# EAGLE design Sensor_v1.0 (EAGLE 9.3.0)

## Sheet 1 of 2
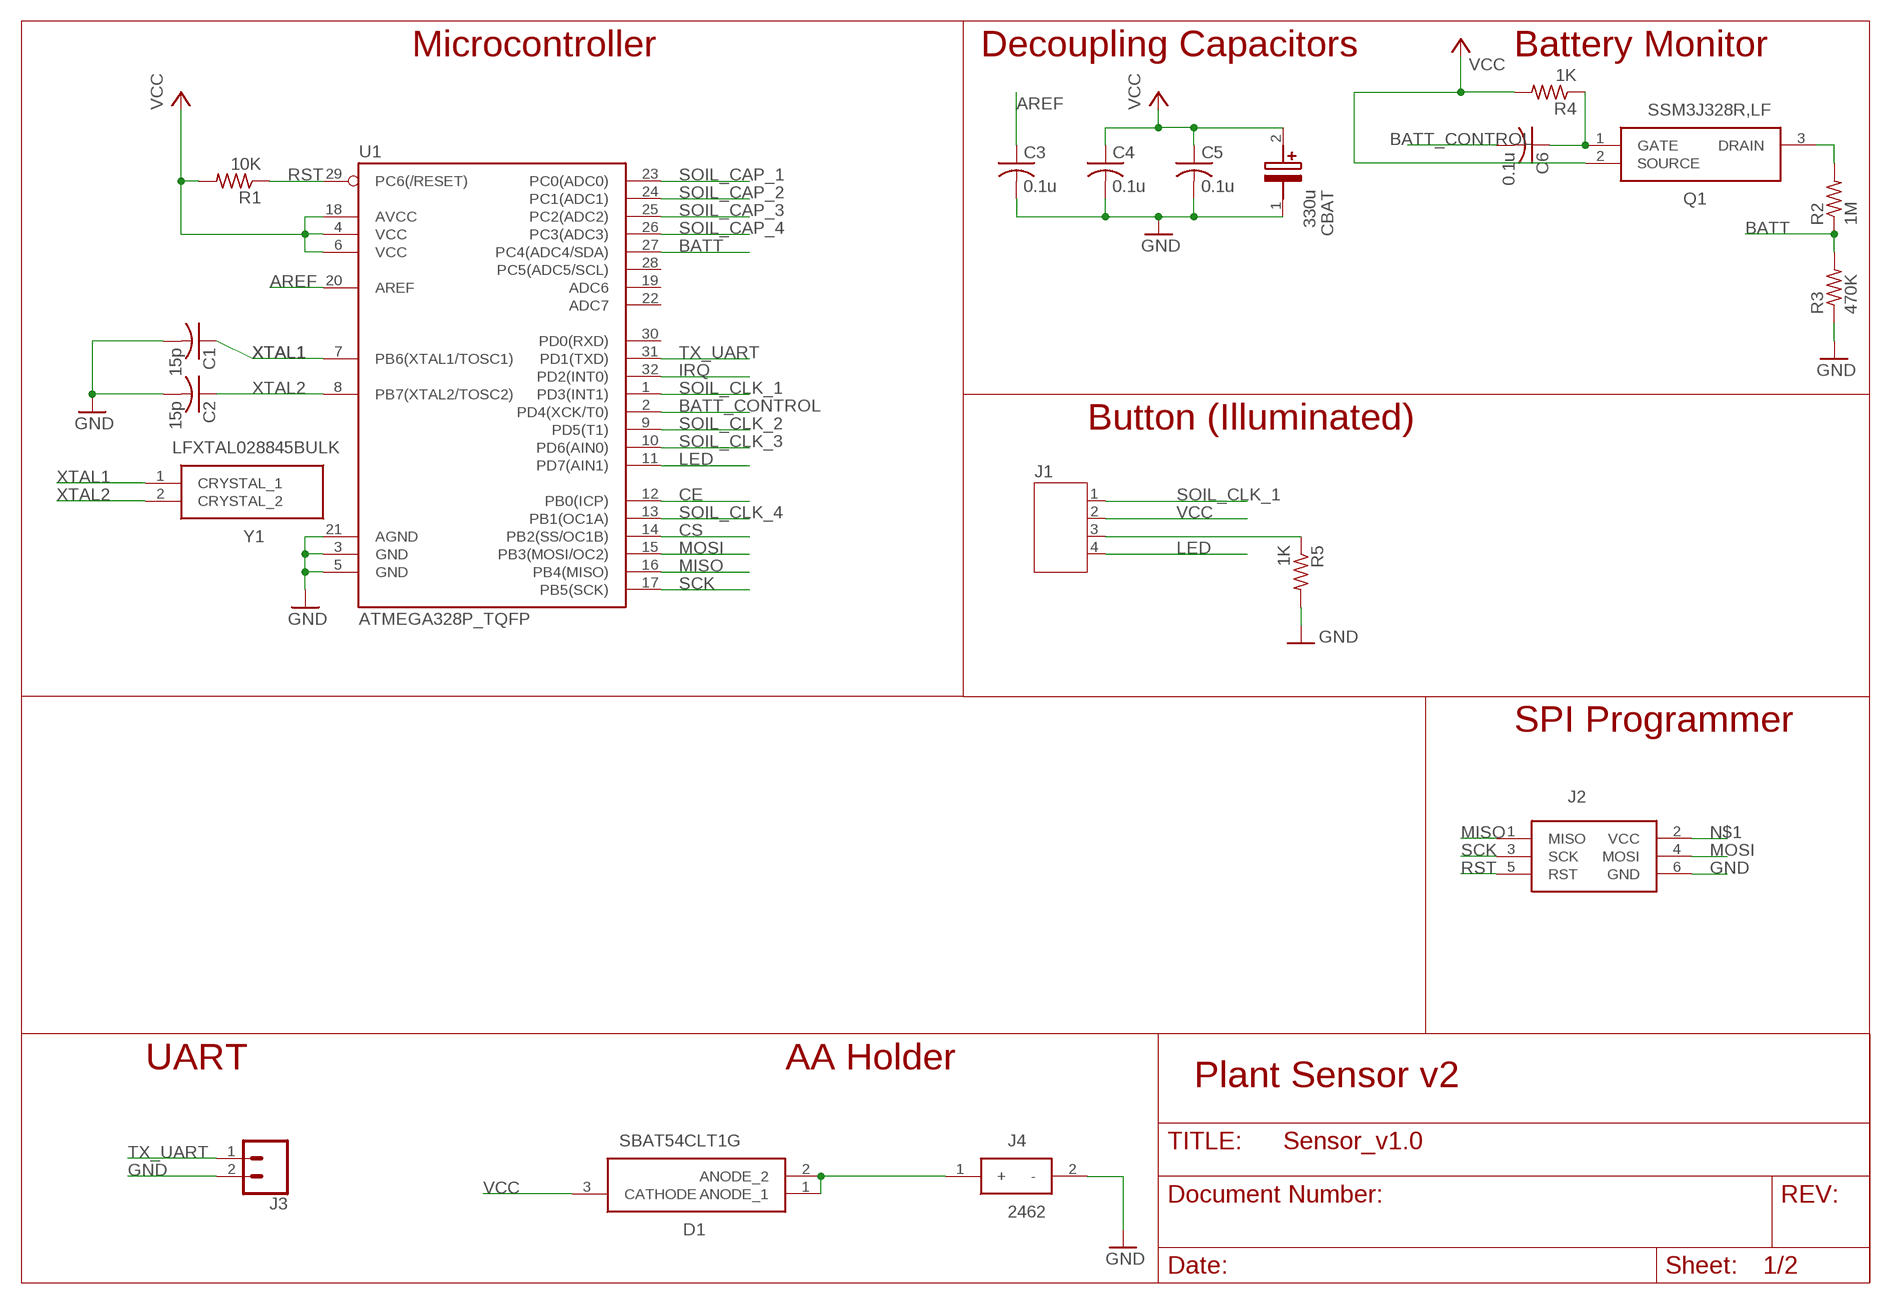
[diagram p0: schematic, sheet 1]

### Parts
C1  15p  CAPACITOR-SMD-0805  [SMD-0805]
C2  15p  CAPACITOR-SMD-0805  [SMD-0805]
C3  0.1u  CAPACITOR-SMD-0805  [SMD-0805]
C4  0.1u  CAPACITOR-SMD-0805  [SMD-0805]
C5  0.1u  CAPACITOR-SMD-0805  [SMD-0805]
C6  0.1u  CAPACITOR-SMD-0805  [SMD-0805]
CBAT  330u  EEE-FNC271XUP  [SMD_LYTIC_D8]
D1  SBAT54CLT1G  [SOT96P237X111-3N]
J1  JST-PH4  [JST-PH4]
J2  ISP  AVRISP-6  [AVRISP]
J3  CONN_02  [1X02]
J4  2462  [2462]
Q1  SSM3J328R,LF  [SOTFL95P240X88-3N]
R1  10K  RESISTOR-SMD-0805  [SMD-0805]
R2  1M  RESISTOR-SMD-0805  [SMD-0805]
R3  470K  RESISTOR-SMD-0805  [SMD-0805]
R4  1K  RESISTOR-SMD-0805  [SMD-0805]
R5  1K  RESISTOR-SMD-0805  [SMD-0805]
U1  ATMEGA328P_TQFP  [TQFP32-08]
Y1  LFXTAL028845BULK  [LFXTAL028845BULK]

### Nets
AREF: C3.1 U1.20(AREF)
BATT: R2.1 R3.2 U1.27(PC4(ADC4/SDA))
BATT_CONTROL: C6.2 U1.2(PD4(XCK/T0))
CE: U1.12(PB0(ICP)) ; also sheet 2
CS: U1.14(PB2(SS/OC1B)) ; also sheet 2
GND: C1.2 C2.2 C3.2 C4.2 C5.2 CBAT.1 J2.6(GND) J3.2 J4.2(-) R3.1 R5.2 U1.3(GND) U1.5(GND) U1.21(AGND) ; also sheet 2
IRQ: U1.32(PD2(INT0)) ; also sheet 2
LED: J1.4 U1.11(PD7(AIN1))
MISO: J2.1(MISO) U1.16(PB4(MISO)) ; also sheet 2
MOSI: J2.4(MOSI) U1.15(PB3(MOSI/OC2)) ; also sheet 2
N$1: J2.2(VCC)
N$2: Q1.3(DRAIN) R2.2
N$3: D1.1(ANODE_1) D1.2(ANODE_2) J4.1(+)
N$7: J1.3 R5.1
N$8: C6.1 Q1.1(GATE) R4.1
RST: J2.5(RST) R1.1 U1.29(PC6(/RESET))
SCK: J2.3(SCK) U1.17(PB5(SCK)) ; also sheet 2
SOIL_CAP_1: U1.23(PC0(ADC0)) ; also sheet 2
SOIL_CAP_2: U1.24(PC1(ADC1)) ; also sheet 2
SOIL_CAP_3: U1.25(PC2(ADC2)) ; also sheet 2
SOIL_CAP_4: U1.26(PC3(ADC3)) ; also sheet 2
SOIL_CLK_1: J1.1 U1.1(PD3(INT1)) ; also sheet 2
SOIL_CLK_2: U1.9(PD5(T1)) ; also sheet 2
SOIL_CLK_3: U1.10(PD6(AIN0)) ; also sheet 2
SOIL_CLK_4: U1.13(PB1(OC1A)) ; also sheet 2
TX_UART: J3.1 U1.31(PD1(TXD))
VCC: C4.1 C5.1 CBAT.2 D1.3(CATHODE) J1.2 Q1.2(SOURCE) R1.2 R4.2 U1.4(VCC) U1.6(VCC) U1.18(AVCC) ; also sheet 2
XTAL1: C1.1 U1.7(PB6(XTAL1/TOSC1)) Y1.1(CRYSTAL_1)
XTAL2: C2.1 U1.8(PB7(XTAL2/TOSC2)) Y1.2(CRYSTAL_2)
Unconnected: U1.19(ADC6) U1.22(ADC7) U1.28(PC5(ADC5/SCL)) U1.30(PD0(RXD))

### Notes on the sheet
- Microcontroller | Decoupling Capacitors | Battery Monitor
- Button (Illuminated)
- SPI Programmer
- UART | AA Holder
- Plant Sensor v2

## Sheet 2 of 2
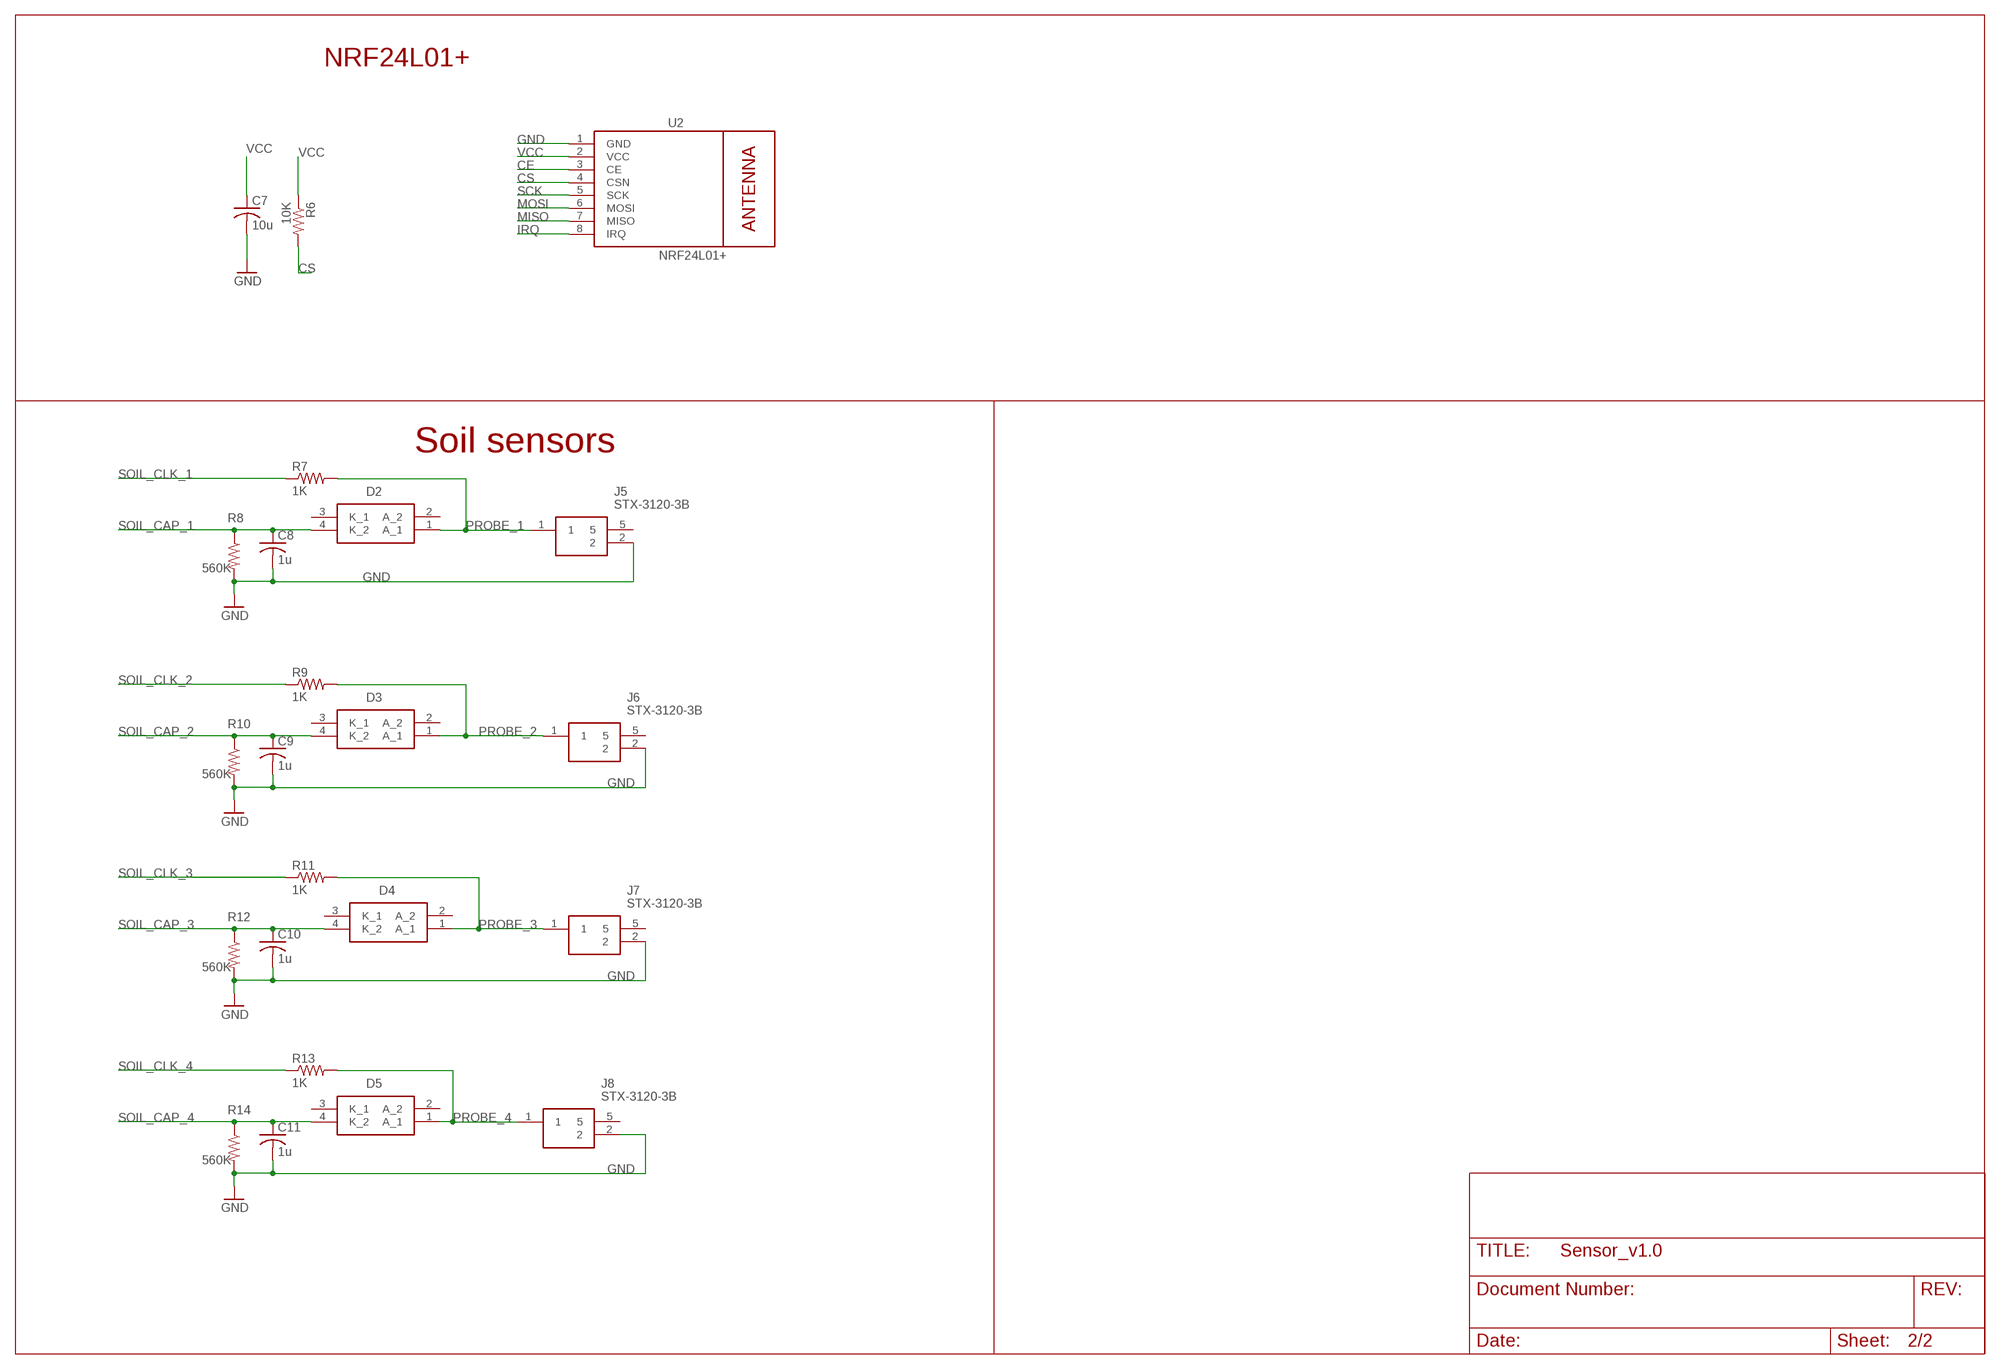
[diagram p1: schematic, sheet 2]

### Parts
C7  10u  CAPACITOR-SMD-0805  [SMD-0805]
C8  1u  CAPACITOR-SMD-0805  [SMD-0805]
C9  1u  CAPACITOR-SMD-0805  [SMD-0805]
C10  1u  CAPACITOR-SMD-0805  [SMD-0805]
C11  1u  CAPACITOR-SMD-0805  [SMD-0805]
D2  1SS384TE85LF  [SOP65P210X110-4N]
D3  1SS384TE85LF  [SOP65P210X110-4N]
D4  1SS384TE85LF  [SOP65P210X110-4N]
D5  1SS384TE85LF  [SOP65P210X110-4N]
J5  STX-3120-3B  [STX31203B]
J6  STX-3120-3B  [STX31203B]
J7  STX-3120-3B  [STX31203B]
J8  STX-3120-3B  [STX31203B]
R6  10K  RESISTOR-SMD-0805  [SMD-0805]
R7  1K  RESISTOR-SMD-0805  [SMD-0805]
R8  560K  RESISTOR-SMD-0805  [SMD-0805]
R9  1K  RESISTOR-SMD-0805  [SMD-0805]
R10  560K  RESISTOR-SMD-0805  [SMD-0805]
R11  1K  RESISTOR-SMD-0805  [SMD-0805]
R12  560K  RESISTOR-SMD-0805  [SMD-0805]
R13  1K  RESISTOR-SMD-0805  [SMD-0805]
R14  560K  RESISTOR-SMD-0805  [SMD-0805]
U2  NRF24L01+  WIRELESS-NRF24L01  [WIRELESS-NRF24L01]

### Nets
CE: U2.3(CE) ; also sheet 1
CS: R6.2 U2.4(CSN) ; also sheet 1
GND: C7.2 C8.2 C9.2 C10.2 C11.2 J5.2 J6.2 J7.2 J8.2 R8.2 R10.2 R12.2 R14.2 U2.1(GND) ; also sheet 1
IRQ: U2.8(IRQ) ; also sheet 1
MISO: U2.7(MISO) ; also sheet 1
MOSI: U2.6(MOSI) ; also sheet 1
PROBE_1: D2.1(A_1) J5.1 R7.2
PROBE_2: D3.1(A_1) J6.1 R9.2
PROBE_3: D4.1(A_1) J7.1 R11.2
PROBE_4: D5.1(A_1) J8.1 R13.2
SCK: U2.5(SCK) ; also sheet 1
SOIL_CAP_1: C8.1 D2.4(K_2) R8.1 ; also sheet 1
SOIL_CAP_2: C9.1 D3.4(K_2) R10.1 ; also sheet 1
SOIL_CAP_3: C10.1 D4.4(K_2) R12.1 ; also sheet 1
SOIL_CAP_4: C11.1 D5.4(K_2) R14.1 ; also sheet 1
SOIL_CLK_1: R7.1 ; also sheet 1
SOIL_CLK_2: R9.1 ; also sheet 1
SOIL_CLK_3: R11.1 ; also sheet 1
SOIL_CLK_4: R13.1 ; also sheet 1
VCC: C7.1 R6.1 U2.2(VCC) ; also sheet 1
Unconnected: D2.2(A_2) D2.3(K_1) D3.2(A_2) D3.3(K_1) D4.2(A_2) D4.3(K_1) D5.2(A_2) D5.3(K_1) J5.5 J6.5 J7.5 J8.5

### Notes on the sheet
- NRF24L01+
- Soil sensors

## Library data of the parts
C1-C11 = Fuzzy:CAPACITOR-SMD-0805
CBAT = SamacSys_Parts:EEE-FNC271XUP: PANASONIC - EEE-FNC271XUP - CAP, 270UF, 16V, ALU ELEC, SMD Source: Datasheet <http://industrial.panasonic.com/cdbs/www-data/pdf/RDE0000/RDE0000C1259.pdf>; DESCRIPTION: PANASONIC - EEE-FNC271XUP - CAP, 270UF, 16V, ALU ELEC, SMD; HEIGHT: 7.8mm; MANUFACTURER_NAME: Panasonic; MANUFACTURER_PART_NUMBER: EEE-FNC271XUP; MOUSER_PART_NUMBER: 667-EEE-FNC271XUP; MOUSER_PRICE-STOCK: https://www.mouser.co.uk/ProductDetail/Panasonic/EEE-FNC271XUP?qs=OlC7AqGiEDk4Wtbs6TVCqQ%3D%3D
D1 = SamacSys_Parts:SBAT54CLT1G: ON SEMICONDUCTOR - SBAT54CLT1G - DIODE, SCHOTTKY, AEC-Q101, 30V, SOT-23 Source: Datasheet <http://www.onsemi.com/pub/Collateral/BAT54CLT1-D.PDF>; DESCRIPTION: ON SEMICONDUCTOR - SBAT54CLT1G - DIODE, SCHOTTKY, AEC-Q101, 30V, SOT-23; HEIGHT: 1.11mm; MANUFACTURER_NAME: ON Semiconductor; MANUFACTURER_PART_NUMBER: SBAT54CLT1G; MOUSER_PART_NUMBER: 863-SBAT54CLT1G; MOUSER_PRICE-STOCK: https://www.mouser.co.uk/ProductDetail/ON-Semiconductor/SBAT54CLT1G?qs=3PKVEWFFm28iDw9tuZM%2FZA%3D%3D
D2-D5 = SamacSys_Parts:1SS384TE85LF: Schottky Diodes & Rectifiers 0.1A 10V Schottky Small Sig Diode Source: Datasheet; DESCRIPTION: Schottky Diodes & Rectifiers 0.1A 10V Schottky Small Sig Diode; HEIGHT: 1.1mm; MANUFACTURER_NAME: Toshiba; MANUFACTURER_PART_NUMBER: 1SS384TE85LF; MOUSER_PART_NUMBER: 757-1SS384TE85LF; MOUSER_PRICE-STOCK: https://www.mouser.co.uk/ProductDetail/Toshiba/1SS384TE85LF?qs=3kEcuH7qFhcYSVeDNmL3eg%3D%3D
J1 = jst-ph:JST-PH4
J2 = adafruit:AVRISP: AVR ISP HEADER Standard 6 pin header for AVR programming
J3 = SparkFun-Connectors:CONN_02: Multi connection point. Often used as Generic Header-pin footprint for 0.1 inch spaced/style header connections On any of the 0.1 inch spaced packages, you can populate with these: Break Away Headers - Straight <https://www.sparkfun.com/products/116> (PRT-00116) Break Away Male Headers - Right Angle <https://www.sparkfun.com/products/553> (PRT-00553) Female Headers <https://www.sparkfun.com/products/115> (PRT-00115) Break Away Headers - Machine Pin <https://www.sparkfun.com/products/117> (PRT-00117) Break Away Female Headers - Swiss Machine Pin <https://www.sparkfun.com/products/743> (PRT-00743) For SCREWTERMINALS and SPRING TERMINALS visit here: Screw Terimnals on SparkFun.com <https://www.sparkfun.com/search/results?term=Screw+Terminals> (5mm/3.5mm/2.54mm spacing) This device is also useful as a general connection point to wire up your design to another part of your project. Our various solder wires solder well into these plated through hole pads. Hook-Up Wire - Assortment (Stranded, 22 AWG) <https://www.sparkfun.com/products/11375> (PRT-11375) Hook-Up Wire - Assortment (Solid Core, 22 AWG) <https://www.sparkfun.com/products/11367> (PRT-11367) View the entire wire category on our website here <https://www.sparkfun.com/categories/141> Special notes: Molex polarized connector foot print use with: PRT-08233 with associated crimp pins and housings. 2.54_SCREWTERM for use with PRT-10571. 3.5mm Screw Terminal footprints for PRT-08084 5mm Screw Terminal footprints for use with PRT-08432
J4 = SamacSys_Parts:2462: KEYSTONE - 2462 - BATTERY HOLDER Source: Datasheet <https://componentsearchengine.com/Datasheets/1/2462.pdf>; DESCRIPTION: KEYSTONE - 2462 - BATTERY HOLDER; HEIGHT: mm; MANUFACTURER_NAME: Keystone Electronics; MANUFACTURER_PART_NUMBER: 2462; MOUSER_PART_NUMBER: 534-2462
J5-J8 = SamacSys_Parts:STX-3120-3B: Phone Connectors 3.5mm PCB STEREO BLK 3P ALL PLASTIC Source: Datasheet <https://componentsearchengine.com/Datasheets/1/STX-3120-3B.pdf>; DESCRIPTION: Phone Connectors 3.5mm PCB STEREO BLK 3P ALL PLASTIC; HEIGHT: 10.8mm; MANUFACTURER_NAME: Kycon; MANUFACTURER_PART_NUMBER: STX-3120-3B; MOUSER_PART_NUMBER: 806-STX-3120-3B; MOUSER_PRICE-STOCK: https://www.mouser.co.uk/ProductDetail/Kycon/STX-3120-3B?qs=tDp7Of2cGGh%2F4wBu%2F49%2FMQ%3D%3D
Q1 = SamacSys_Parts:SSM3J328R,LF: MOSFET P-Ch Sm Sig FET Id -6A -20V -8VGSS Source: Datasheet <https://componentsearchengine.com/Datasheets/1/SSM3J328R,LF.pdf>; DESCRIPTION: MOSFET P-Ch Sm Sig FET Id -6A -20V -8VGSS; HEIGHT: 0.88mm; MANUFACTURER_NAME: Toshiba; MANUFACTURER_PART_NUMBER: SSM3J328R,LF; MOUSER_PART_NUMBER: 757-SSM3J328RLF
R1-R14 = Fuzzy:RESISTOR-SMD-0805
U1 = SparkFun-IC-Microcontroller:ATMEGA328P_TQFP: Popular 328P in QFP Storefront component: ATmega328 - TQFP <https://www.sparkfun.com/products/13448> (COM-13448) Datasheet <http://www.sparkfun.com/datasheets/Components/SMD/ATMega328.pdf> SparkFun Products SparkFun RedBoard - Programmed with Arduino <https://www.sparkfun.com/products/12757> (DEV-12757) Arduino Pro Mini 328 - 5V/16MHz <https://www.sparkfun.com/products/11113> (DEV-11113) Arduino Pro Mini 328 - 3.3V/8MHz <https://www.sparkfun.com/products/11114> (DEV-11114) SparkFun OpenLog <https://www.sparkfun.com/products/13712> (DEV-13712) SparkFun MicroView - OLED Arduino Module <https://www.sparkfun.com/products/12923> (DEV-12923) SparkFun Digital Sandbox <https://www.sparkfun.com/products/12651> (DEV-12651) SparkFun PicoBoard <https://www.sparkfun.com/products/11888> (WIG-11888) Arduino Fio <https://www.sparkfun.com/products/10116> (DEV-10116) LilyPad Arduino 328 Main Board <https://www.sparkfun.com/products/13342> (DEV-13342) SparkFun RedStick <https://www.sparkfun.com/products/13741> (DEV-13741) LilyPad MP3 <https://www.sparkfun.com/products/11013> (DEV-11013) LilyPad Arduino SimpleSnap <https://www.sparkfun.com/products/10941> (DEV-10941) SparkFun Stepoko <https://www.sparkfun.com/products/13899> (ROB-13899) SparkFun Geiger Counter <https://www.sparkfun.com/products/11345> (SEN-11345) SparkFun EL Sequencer <https://www.sparkfun.com/products/12781> (COM-12781) Arduino Pro 328 - 5V/16MHz <https://www.sparkfun.com/products/10915> (DEV-10915) CryptoCape <https://www.sparkfun.com/products/12773> (DEV-12773) SparkFun IR Thermometer Evaluation Board - MLX90614 <https://www.sparkfun.com/products/10740> (SEN-10740) SparkFun RedBot Mainboard <https://www.sparkfun.com/products/12097> (ROB-12097) Arduino Pro 328 - 3.3V/8MHz <https://www.sparkfun.com/products/10914> (DEV-10914) SparkFun Block for Intel® Edison - Arduino <https://www.sparkfun.com/products/13036> (DEV-13036) SparkFun Simon Says - Surface Mount Soldering Kit <https://www.sparkfun.com/products/10935> (KIT-10935) SparkFun 7-Segment Serial Display - Red <https://www.sparkfun.com/products/11441> (COM-11441) SparkFun 7-Segment Serial Display - White <https://www.sparkfun.com/products/11629> (COM-11629) SparkFun 7-Segment Serial Display - Yellow <https://www.sparkfun.com/products/11443> (COM-11443) SparkFun 7-Segment Serial Display - Kelly Green <https://www.sparkfun.com/products/11440> (COM-11440) SparkFun 7-Segment Serial Display - Blue <https://www.sparkfun.com/products/11442> (COM-11442) SparkFun OpenSegment Serial Display - 20mm (Blue) <https://www.sparkfun.com/products/11647> (COM-11647) SparkFun OpenSegment Serial Display - 20mm (Green) <https://www.sparkfun.com/products/11646> (COM-11646) SparkFun OpenSegment Serial Display - 20mm (White) <https://www.sparkfun.com/products/11648> (COM-11648) SparkFun OpenSegment Serial Display - 20mm (Red) <https://www.sparkfun.com/products/11644> (COM-11644) SparkFun OpenSegment Serial Display - 20mm (Yellow) <https://www.sparkfun.com/products/11645> (COM-11645) SparkFun OpenSegment Shield <https://www.sparkfun.com/products/13190> (DEV-13190); PROD_ID: IC-09069
U2 = diy-modules:WIRELESS-NRF24L01: 2.4 GHz Wireless Module based on NRF24L01 chip More details available here: http://www.electrodragon.com/w/NRF24L01 Click here to find device on ebay.com <http://www.ebay.com/sch/nrf24l01+arduino>
Y1 = SamacSys_Parts:LFXTAL028845BULK: Crystals 4MHz 12pF -20C 70C Source: Datasheet; DESCRIPTION: Crystals 4MHz 12pF -20C 70C; HEIGHT: 4.3mm; MANUFACTURER_NAME: IQD; MANUFACTURER_PART_NUMBER: LFXTAL028845BULK

## Net classes
0 default: width 0.254 mm, drill 0.508 mm, clearance 0.203 mm

## Board
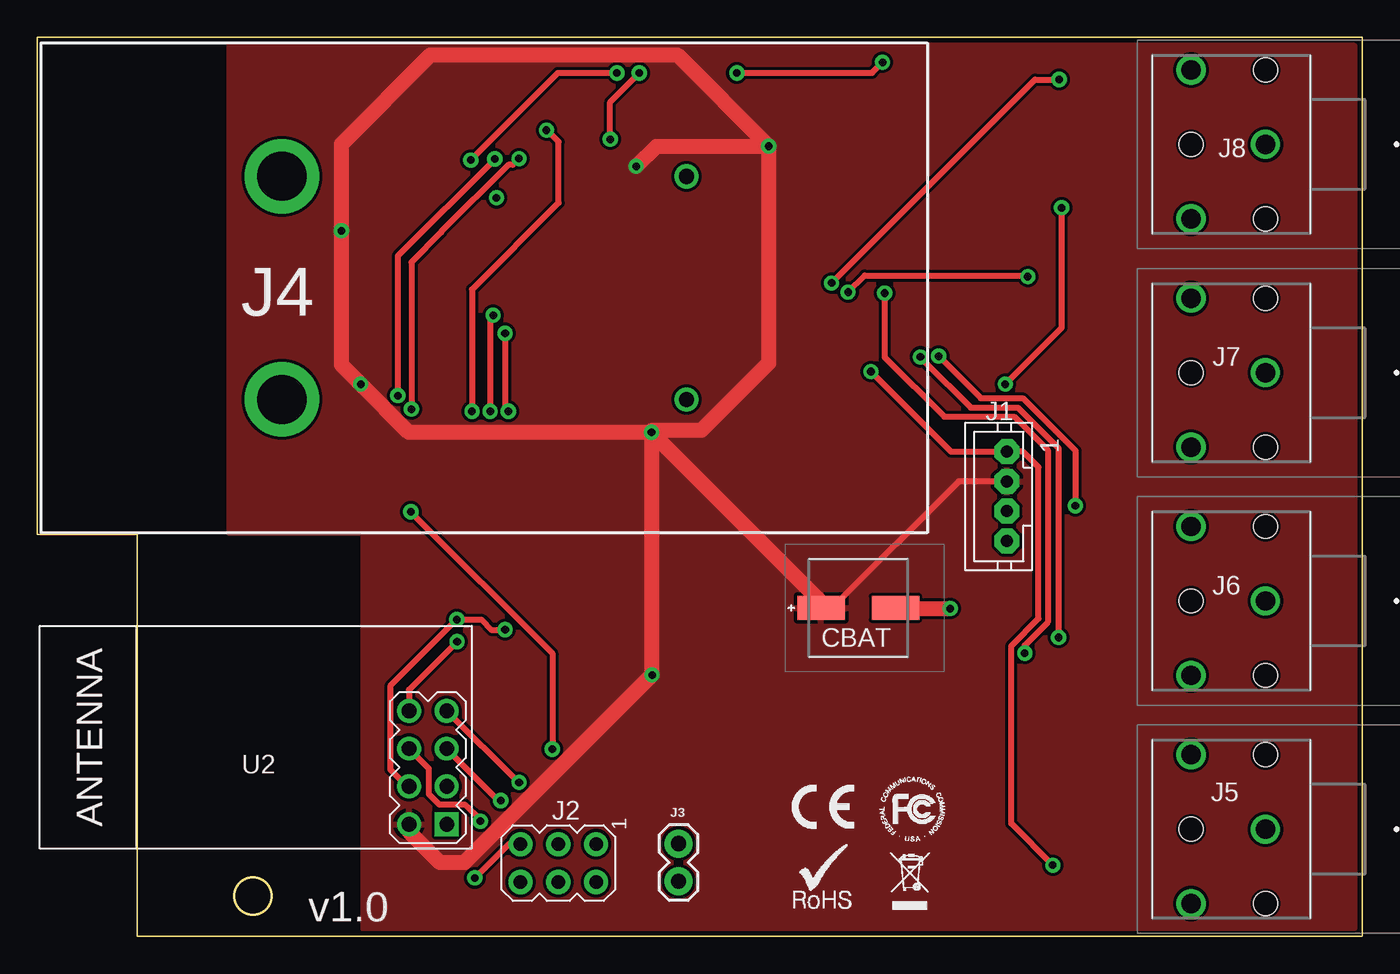
[diagram p2: board, top side]
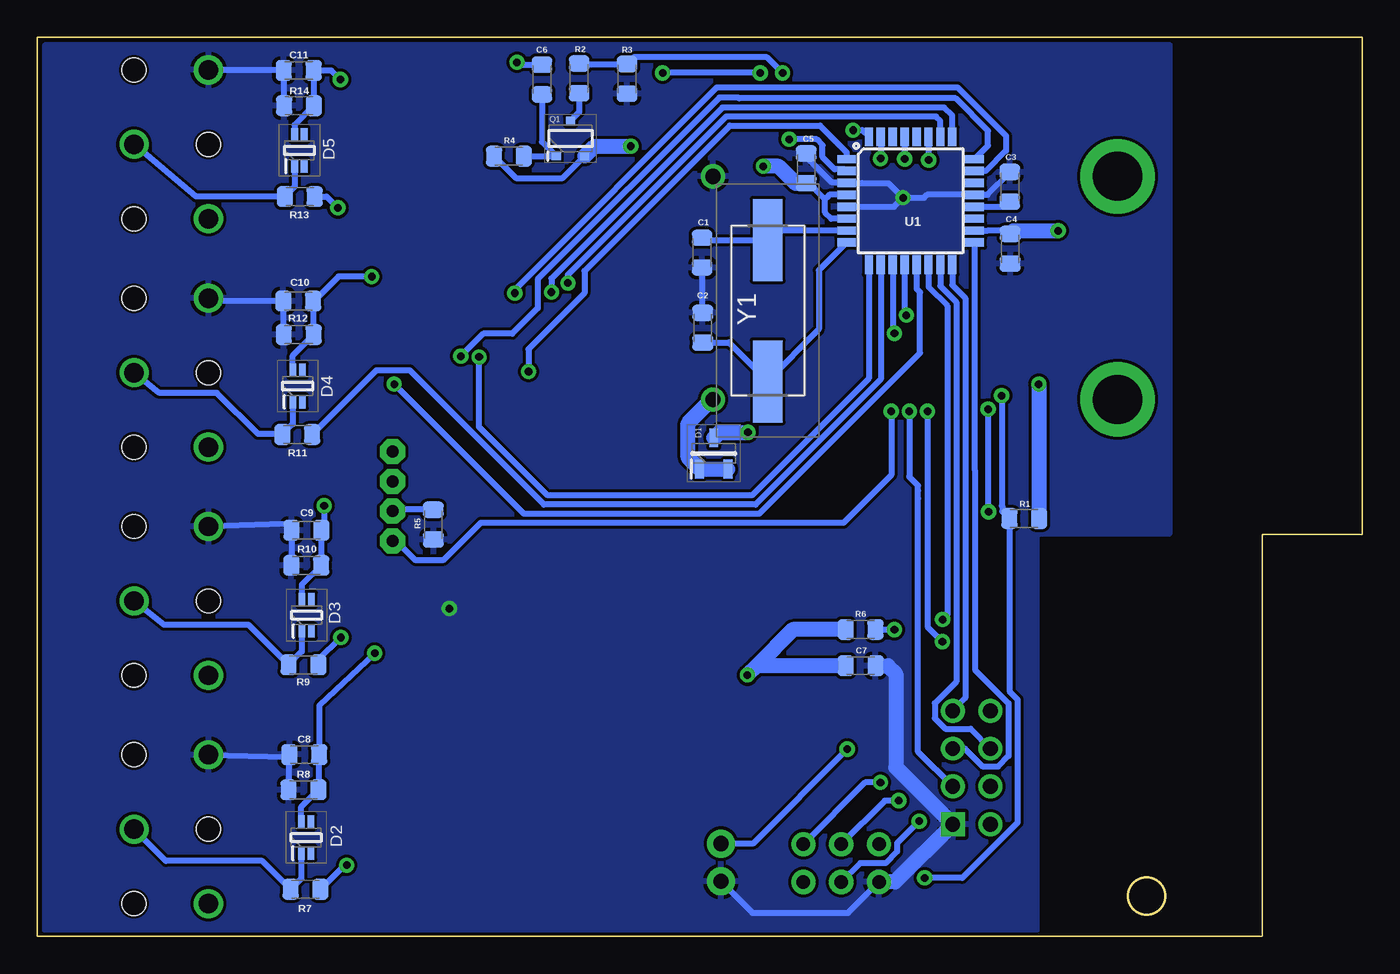
[diagram p3: board, bottom side, seen from below]

Size 89 x 60.4 mm. Coordinates in mm from the lower left corner, seen from the top.
Outline: 0,60.4 0,27 6.7,27 6.7,0 89,0 89,60.4 0,60.4
Outline: circle at 14.5,2.7 radius 1.25
Copper layers (1*16): Top 0.035mm / dielectric 1.5mm / Bottom 0.035mm
Design rules "SparkFun": minimum track width 8mil, minimum drill 20mil, track to track 8mil, track to pad 8mil, pad to pad 8mil, via to via 8mil, smd to smd 8mil, copper to edge 8mil, drill to drill 8mil, minimum pad ring 12mil, minimum via ring 10mil, stop-mask expansion 4mil, vias tented up to drill 20mil, thermal gap 10mil

### Footprints (pad centres in the part's own frame; a part is rotated, then mirrored left to right if it is on the bottom)
SMD-0805 = smd 1.1 x 1.4: 1 -1,0; 2 1,0
SMD_LYTIC_D8 = smd 3.2 x 1.6: 1 -2.5,0; 2 2.5,0
SOT96P237X111-3N = smd 1.25 x 0.6: 1 -1.05,0.955; 2 -1.05,-0.955; 3 1.05,0
SOP65P210X110-4N = smd 0.875 x 0.45: 1 -1.062,0.325; 2 -1.062,-0.325; 3 1.062,-0.325; 4 1.062,0.325
JST-PH4 = drill 0.813 pad 1.676 octagon: 1 3,0; 2 1,0; 3 -1,0; 4 -3,0
AVRISP = drill 0.9 pad 1.626: 1 -1.27,2.54; 2 1.27,2.54; 3 -1.27,0; 4 1.27,0; 5 -1.27,-2.54; 6 1.27,-2.54
1X02 = drill 1.016 pad 1.88: 1 0,0; 2 2.54,0
2462 = drill 1.02 pad 1.6: 1 13.59,-7.495; 2 13.59,7.495 | drill 3.3 pad 5: 3 -13.59,7.495; 4 -13.59,-7.495
STX31203B = drill 1.3 pad 1.95: 1 0,0; 2 5,-5; 5 5,5 | hole 1.6: 0,-5; 0,5; 5,0
SOTFL95P240X88-3N = smd 0.575 x 0.62: 1 -1.188,0.95; 2 -1.188,-0.95; 3 1.188,0
TQFP32-08 = smd 1.27 x 0.559: 1 -4.293,2.8; 2 -4.293,2; 3 -4.293,1.2; 4 -4.293,0.4; 5 -4.293,-0.4; 6 -4.293,-1.2; 7 -4.293,-2; 8 -4.293,-2.8; 17 4.293,-2.8; 18 4.293,-2; 19 4.293,-1.2; 20 4.293,-0.4; 21 4.293,0.4; 22 4.293,1.2; 23 4.293,2; 24 4.293,2.8 | smd 0.559 x 1.27: 9 -2.8,-4.293; 10 -2,-4.293; 11 -1.2,-4.293; 12 -0.4,-4.293; 13 0.4,-4.293; 14 1.2,-4.293; 15 2,-4.293; 16 2.8,-4.293; 25 2.8,4.293; 26 2,4.293; 27 1.2,4.293; 28 0.4,4.293; 29 -0.4,4.293; 30 -1.2,4.293; 31 -2,4.293; 32 -2.8,4.293
WIRELESS-NRF24L01 = drill 1 square: 1 -12.7,6.35 | drill 1: 2 -10.16,6.35; 3 -12.7,3.81; 4 -10.16,3.81; 5 -12.7,1.27; 6 -10.16,1.27; 7 -12.7,-1.27; 8 -10.16,-1.27
LFXTAL028845BULK = smd 5.5 x 2: 1 -4.75,0; 2 4.75,0

### Placement (x,y rotation side)
C1  44.34,45.93 270 bottom
C2  44.3,40.89 90 bottom
C3  23.68,50.35 90 bottom
C4  23.65,46.19 270 bottom
C5  37.35,51.59 90 bottom
C6  55.1,57.55 90 bottom
C7  33.69,18.18 0 bottom
C8  71.06,12.21 180 bottom
C9  70.92,27.28 180 bottom
C10  71.47,42.68 180 bottom
C11  71.44,58.17 180 bottom
CBAT  55.15,22.06 180 top
D1  43.56,32.44 90 bottom
D2  70.94,6.64 90 bottom
D3  70.9,21.57 90 bottom
D4  71.51,36.97 90 bottom
D5  71.39,52.8 90 bottom
J1  65.14,29.56 90 top
J2  35,4.92 270 top
J3  43.08,6.23 270 top
J4  30.02,43.56 0 top
J5  82.5,7.2 180 top
J6  82.5,22.53 180 top
J7  82.5,37.86 180 top
J8  82.5,53.2 180 top
Q1  53.18,53.6 90 bottom
R1  22.7,28.07 0 bottom
R2  52.6,57.64 270 bottom
R3  49.39,57.6 90 bottom
R4  57.32,52.41 180 bottom
R5  62.39,27.66 270 bottom
R6  33.7,20.61 0 bottom
R7  70.98,3.16 180 bottom
R8  71.12,9.85 180 bottom
R9  71.12,18.24 180 bottom
R10  70.93,24.92 180 bottom
R11  71.53,33.71 180 bottom
R12  71.44,40.42 180 bottom
R13  71.37,49.7 180 bottom
R14  71.42,55.8 180 bottom
U1  30.34,49.41 0 bottom
U2  14.81,13.88 180 top
Y1  39.93,42.03 270 bottom

### Tracks (layer width: path | path; a pad name or v marks a point on that pad's centre or on a via)
AREF
  Bottom 0.406: C3.1 24.02,49.01 U1.20
BATT  (via drill 0.51)
  Top 0.406: v38.94,58 34.97,58 v29.12,52.15
  Bottom 0.406: R2.1 52.56,58.6 R3.2 48.95,59.04 39.98,59.04 v38.94,58 | U1.27 29.14,52.17 v29.12,52.15
BATT_CONTROL  (via drill 0.51)
  Top 0.406: v38.49,53.55 38.49,56.05 v40.44,58 | v46.99,58 56.07,58 v56.78,58.71
  Bottom 0.406: U1.2 34.75,51.52 35.44,51.52 36.24,52.33 36.24,53.15 36.64,53.55 38.06,53.55 v38.49,53.55 | v40.44,58 v46.99,58 | v56.78,58.71 56.62,58.55 C6.2
CE  (via drill 0.51)
  Top 0.406: v30.63,41.73 30.41,41.51 v30.41,35.28 v30.42,35.27
  Bottom 0.406: U1.12 30.74,41.84 v30.63,41.73 | v30.42,35.27 30.42,30.91 30.45,30.89 29.83,30.27 29.83,29.93 29.84,29.92 29.84,29.42 29.83,29.41 29.83,12.39 U2.3
CS  (via drill 0.51)
  Top 0.406: U2.4 24.85,10.07 23.71,11.21 23.71,16.81 v28.18,21.28 29.83,21.28 30.53,20.58 31.4,20.58 v31.42,20.6
  Bottom 0.406: U1.14 29.14,43.63 27.88,42.36 27.88,21.59 v28.18,21.28 | R6.2 31.43,20.61 v31.42,20.6
GND  (via drill 0.51)
  Top 1.016: CBAT.1 57.69,22.02 v61.32,22.02
  Bottom 0.406: C3.2 23.68,51.3 25.17,49.81 U1.21 29.23,49.81 29.43,49.61 v30.85,49.61 | U1.5 31.45,49.01 v30.85,49.61 | C5.2 37.35,52.37 35.61,50.63 34.65,50.63 U1.3 33.6,50.61 33.58,50.59 31.82,50.59 v30.85,49.61 | J5.2 72.22,12.05 C8.2 72.12,12.15 R8.2 | R10.2 C9.2 72.34,27.7 J6.2 | J7.2 76.97,42.68 C10.2 72.47,40.45 R12.2 | R14.2 72.44,55.82 C11.2 77.01,58.17 J8.2 | C1.2 44.34,41.93 C2.2 | J3.2 40.96,1.57 34.54,1.57 J2.6
  Bottom 1.016: J2.6 31.39,3.65 U2.1 31.33,11.35 31.33,17.65 31.86,18.18 C7.2
  pour Bottom: 45.51,34.45 35.29,34.45 35.29,50.55 45.51,50.55
  pour Bottom: 21.85,26.9 21.78,26.97 21.68,27.07 12.94,27.07 12.94,59.82 12.9,59.86 88.48,59.86 88.48,0.51 88.52,0.47 21.85,0.47 21.84,0.48 21.86,0.51 21.84,0.53
IRQ  (via drill 0.51)
  Top 0.406: v29.2,35.27 29.2,43.45 35.02,49.27 35.02,53.38 34.25,54.16 v34.2,54.16 | v28.2,19.79 24.97,16.56 U2.8
  Bottom 0.406: v29.2,35.27 29.2,20.79 v28.2,19.79 | v34.2,54.16 33.59,54.16 U1.32
LED  (via drill 0.51)
  Top 0.406: v31.43,40.51 31.43,35.48 v31.64,35.27
  Bottom 0.406: U1.11 31.54,40.62 v31.43,40.51 | v31.64,35.27 31.64,30.98 34.84,27.78 59.22,27.78 61.75,25.25 63.58,25.25 64.89,26.56 J1.4
MISO  (via drill 0.51)
  Top 0.406: U2.7 32.32,10.34 v32.36,10.34
  Bottom 0.406: U1.16 27.54,43.76 26.66,42.88 26.66,16 U2.7 | v32.36,10.34 33.39,10.34 J2.1
MOSI  (via drill 0.51)
  Top 0.406: v29.76,7.74 29.76,7.82 28.72,8.86 27.01,8.86 26.3,9.57 26.3,11.28 U2.6
  Bottom 0.406: U1.15 28.34,43.69 27.27,42.62 27.27,17.11 28.72,15.65 28.72,14.65 28.01,13.94 26.3,13.94 U2.6 | v29.76,7.74 31.24,6.26 31.24,5.68 32.01,4.92 33.73,4.92 J2.4
N$2
  Bottom 0.406: R2.2 52.6,55.37 Q1.3
N$3
  Bottom 1.016: J4.1 43.7,36.06 45.28,34.48 45.28,32.16 D1.1 D1.2
N$7
  Bottom 0.406: R5.1 65.04,28.66 J1.3
N$8
  Bottom 0.406: C6.1 55.1,53.38 Q1.1 R4.1
PROBE_1
  Bottom 0.406: D2.1 71.27,3.88 R7.2 73.89,5.07 80.37,5.07 J5.1
PROBE_2
  Bottom 0.406: J6.1 80.48,20.92 74.8,20.92 R9.2 71.22,19.14 D3.1
PROBE_3
  Bottom 0.406: J7.1 80.8,36.51 76.94,36.51 74.17,33.74 72.5,33.74 | D4.1 71.83,34.41 72.5,33.74 | 72.5,33.74 R11.2
PROBE_4
  Bottom 0.406: J8.1 78.34,49.7 R13.2 71.72,50.35 D5.1
RST  (via drill 0.51)
  Top 0.406: v24.22,36.33 24.22,45.7 v30.74,52.22 | v29.39,3.92 31.66,6.19 J2.5
  Bottom 0.406: U1.29 v30.74,52.22 | v24.22,36.33 24.22,28.94 24.18,28.9 24.18,28.55 R1.1 23.7,16.45 23.15,15.9 23.15,7.64 26.87,3.92 v29.39,3.92
SCK  (via drill 0.51)
  Top 0.406: U2.5 31,9.12 v31.14,9.12
  Bottom 0.406: U1.17 26.05,31.33 26.01,31.29 26.01,17.9 23.76,15.65 23.76,12.11 24.47,11.4 25.47,11.4 26.68,12.61 U2.5 | v31.14,9.12 32.07,9.12 J2.3
SOIL_CAP_1  (via drill 0.51)
  Top 0.406: v56.92,43.21 56.92,38.91 60.92,34.91 65.63,34.91 67.87,32.67 67.87,21.09 66.33,19.55 v66.33,19.02
  Bottom 0.406: v56.92,43.21 56.92,43.46 43.37,57.01 27.17,57.01 23.93,53.77 23.93,52.77 25.29,51.41 U1.23 | v66.33,19.02 70.06,15.51 C8.1 70.06,9.91 R8.1 71.27,8.71 D2.4
SOIL_CAP_2  (via drill 0.51)
  Top 0.406: v60.55,38.97 63.37,36.15 66.2,36.15 69.73,32.62 v69.73,28.93
  Bottom 0.406: U1.24 25.13,53.13 25.13,54.11 27.31,56.29 41.86,56.29 41.91,56.34 43.18,56.34 55.38,44.14 55.38,42.2 57.09,40.49 59.05,40.49 60.55,38.99 v60.55,38.97 | v69.73,28.93 69.73,27.47 C9.1 R10.1 71.22,23.62 D3.4
SOIL_CAP_3  (via drill 0.51)
  Top 0.406: v54.47,43.28 55.59,44.4 66.45,44.4 v66.53,44.32
  Bottom 0.406: U1.25 27.54,55.15 28.07,55.68 42.98,55.68 54.47,44.19 v54.47,43.28 | v66.53,44.32 68.77,44.32 70.41,42.68 C10.1 70.47,40.45 R12.1 71.83,39.02 D4.4
SOIL_CAP_4  (via drill 0.51)
  Top 0.406: v68.64,57.56 67.03,57.56 v53.35,43.89
  Bottom 0.406: U1.26 28.34,54.78 28.63,55.07 42.72,55.07 53.35,44.44 v53.35,43.89 | v68.64,57.56 69.25,58.17 C11.1 70.44,55.82 R14.1 71.72,54.51 D5.4
SOIL_CLK_1  (via drill 0.51)
  Top 0.406: v56,37.94 61.38,32.56 J1.1 66.22,32.56 67.26,31.52 67.26,21.34 65.42,19.5 65.42,7.57 v68.21,4.78
  Bottom 0.406: v68.21,4.78 68.36,4.78 R7.1 | U1.1 34.63,52.67 36.42,54.46 42.47,54.46 52.24,44.69 52.24,43.21 56,39.45 v56,37.94
SOIL_CLK_2  (via drill 0.51)
  Top 0.406: v59.32,38.92 59.64,38.61 59.64,38.59 62.71,35.52 65.88,35.52 68.6,32.8 v68.6,20.08
  Bottom 0.406: R9.1 70.12,18.56 v68.6,20.08 | v59.32,38.92 59.32,34.22 54.72,29.62 41.01,29.62 33.14,37.48 U1.9
SOIL_CLK_3
  Bottom 0.406: R11.1 66.23,38.01 63.97,38.01 54.97,29.01 40.75,29.01 32.34,37.42 U1.10
SOIL_CLK_4  (via drill 0.51)
  Top 0.406: v68.81,48.94 68.81,40.89 v65.02,37.1
  Bottom 0.406: U1.13 29.94,43.5 29.71,43.27 29.71,39.19 40.5,28.4 56.32,28.4 v65.02,37.1 | R13.1 69.57,49.7 v68.81,48.94
TX_UART  (via drill 0.51)
  Top 0.406: v32.36,52.25 31.94,51.83 31.64,51.83 27.14,47.33 27.14,47.29 25.13,45.28 v25.13,35.41 | v25.1,28.52 34.6,19.02 v34.6,12.57
  Bottom 0.406: U1.31 32.34,52.27 v32.36,52.25 | v25.13,35.41 25.13,28.56 v25.1,28.52 | v34.6,12.57 40.94,6.23 J3.1
VCC  (via drill 0.51)
  Top 0.406: J1.2 61.89,30.56 53.39,22.06 CBAT.2
  Top 1.016: v49.13,53.08 49.13,38.51 44.63,34.01 41.3,34.01 v41.3,17.55 28.71,4.96 27.04,4.96 24.97,7.03 U2.2 | v49.13,53.08 42.99,59.22 26.42,59.22 20.43,53.23 v20.43,47.4 20.43,38.39 v21.73,37.09 24.96,33.86 v41.26,33.86 52.65,22.47 CBAT.2 | v40.23,51.73 41.58,53.08 v49.13,53.08
  Bottom 0.406: U1.6 35.66,48.21 35.67,48.2 36.09,48.62 36.09,49.51 36,49.6 | C5.1 37.17,50.59 36.18,49.6 36,49.6 | U1.4 35.79,49.81 36,49.6 | U1.18 25.13,47.41 25.1,47.44 23.9,47.44 C4.1 | R4.2 56.85,50.94 53.7,50.94 Q1.2
  Bottom 1.016: D1.3 43.19,33.86 v41.26,33.86 | C4.1 23.44,47.4 v20.43,47.4 | C5.1 38.06,50.59 39.2,51.73 v40.23,51.73 | C7.1 40.67,18.18 | 40.67,18.18 v41.3,17.55 | R1.2 21.7,37.07 v21.73,37.09 | Q1.2 51.56,53.08 v49.13,53.08 | R6.1 38.24,20.61 40.67,18.18
  pour Top: 12.95,59.86 88.42,59.86 88.47,59.81 88.47,0.56 88.48,0.55 21.97,0.55 21.92,0.5 21.92,26.97 21.8,27.09 12.92,27.09 12.92,59.83
XTAL1
  Bottom 0.406: U1.7 39.3,47.41 Y1.1 44.19,46.78 C1.1
XTAL2
  Bottom 0.406: U1.8 36.5,44.74 36.5,40.78 39.97,37.31 | C2.1 42.54,39.89 39.97,37.31 | 39.97,37.31 Y1.2

### Text on the board
tPlace: v1.0